# Altium schematic sheet Extend.SchDoc
size A4
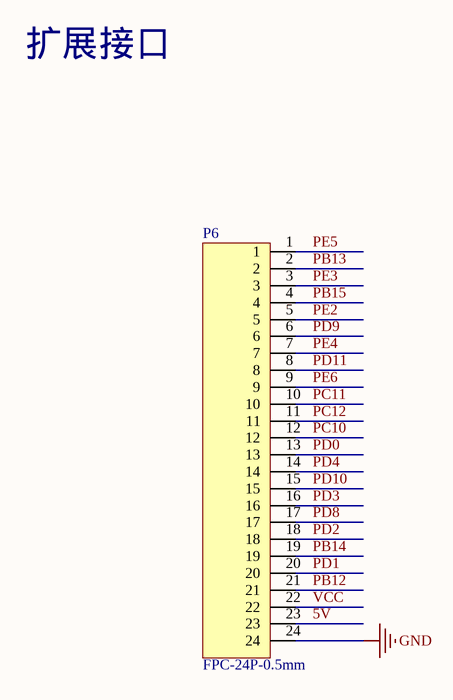
[diagram p0: Extend.SchDoc]

## Parts
P6  FPC-24P-0.5mm  [FPC24-0.5mm]

## Nets
GND: P6.24
5V: P6.23
PB12: P6.21
PB13: P6.2
PB14: P6.19
PB15: P6.4
PC10: P6.12
PC11: P6.10
PC12: P6.11
PD0: P6.13
PD1: P6.20
PD2: P6.18
PD3: P6.16
PD4: P6.14
PD8: P6.17
PD9: P6.6
PD10: P6.15
PD11: P6.8
PE2: P6.5
PE3: P6.3
PE4: P6.7
PE5: P6.1
PE6: P6.9
VCC: P6.22

## Notes on the sheet
- 扩展接口

## Library data of the parts
P6 = FPC-24-0.5mm: 物料名称: FPC座; 物料编码: NA; 单位: PCS; 制造商: 深圳; 物料规格: FPC-24P-0.5mm; 物料型号: FPC-24P-0.5mm